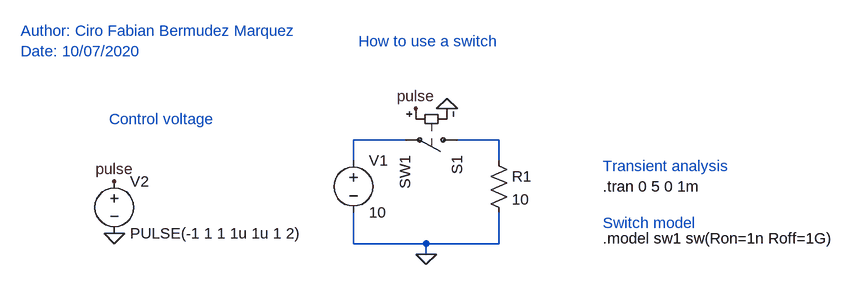
[diagram p0: schematic Switch_example.asc]
Switch_example.asc, the LTspice schematic file:
Version 4
SHEET 1 880 680
WIRE 160 48 80 48
WIRE 304 48 240 48
WIRE 80 80 80 48
WIRE 304 80 304 48
WIRE 80 208 80 160
WIRE 192 208 80 208
WIRE 304 208 304 160
WIRE 304 208 192 208
WIRE 192 224 192 208
FLAG 192 224 0
FLAG -288 192 0
FLAG -288 112 pulse
FLAG 224 0 0
FLAG 176 0 pulse
SYMBOL voltage 80 64 R0
WINDOW 123 0 0 Left 0
WINDOW 39 0 0 Left 0
SYMATTR InstName V1
SYMATTR Value 10
SYMBOL voltage -288 96 R0
WINDOW 123 0 0 Left 0
WINDOW 39 0 0 Left 0
SYMATTR InstName V2
SYMATTR Value PULSE(-1 1 1 1u 1u 1 2)
SYMBOL res 288 64 R0
SYMATTR InstName R1
SYMATTR Value 10
SYMBOL sw 256 48 R90
SYMATTR InstName S1
SYMATTR Value SW1
TEXT 464 200 Left 2 !.model sw1 sw(Ron=1n Roff=1G)
TEXT 464 120 Left 2 !.tran 0 5 0 1m
TEXT 464 88 Left 2 ;Transient analysis
TEXT 464 176 Left 2 ;Switch model
TEXT -296 16 Left 2 ;Control voltage
TEXT 88 -104 Left 2 ;How to use a switch
TEXT -432 -120 Left 2 ;Author: Ciro Fabian Bermudez Marquez\nDate: 10/07/2020

The netlist it stands for:
* Switch_example.asc
V1 N001 0 10
V2 pulse 0 PULSE(-1 1 1 1u 1u 1 2)
R1 N002 0 10
S1 N002 N001 pulse 0 SW1
.model sw1 sw(Ron=1n Roff=1G)
.tran 0 5 0 1m
* Transient analysis
* Switch model
* Control voltage
* How to use a switch
* Author: Ciro Fabian Bermudez Marquez
* Date: 10/07/2020
.backanno
.end